# EAGLE design LB_BIT_o14_BRIGHTLED-v03(rev3) (EAGLE 6.6.0)
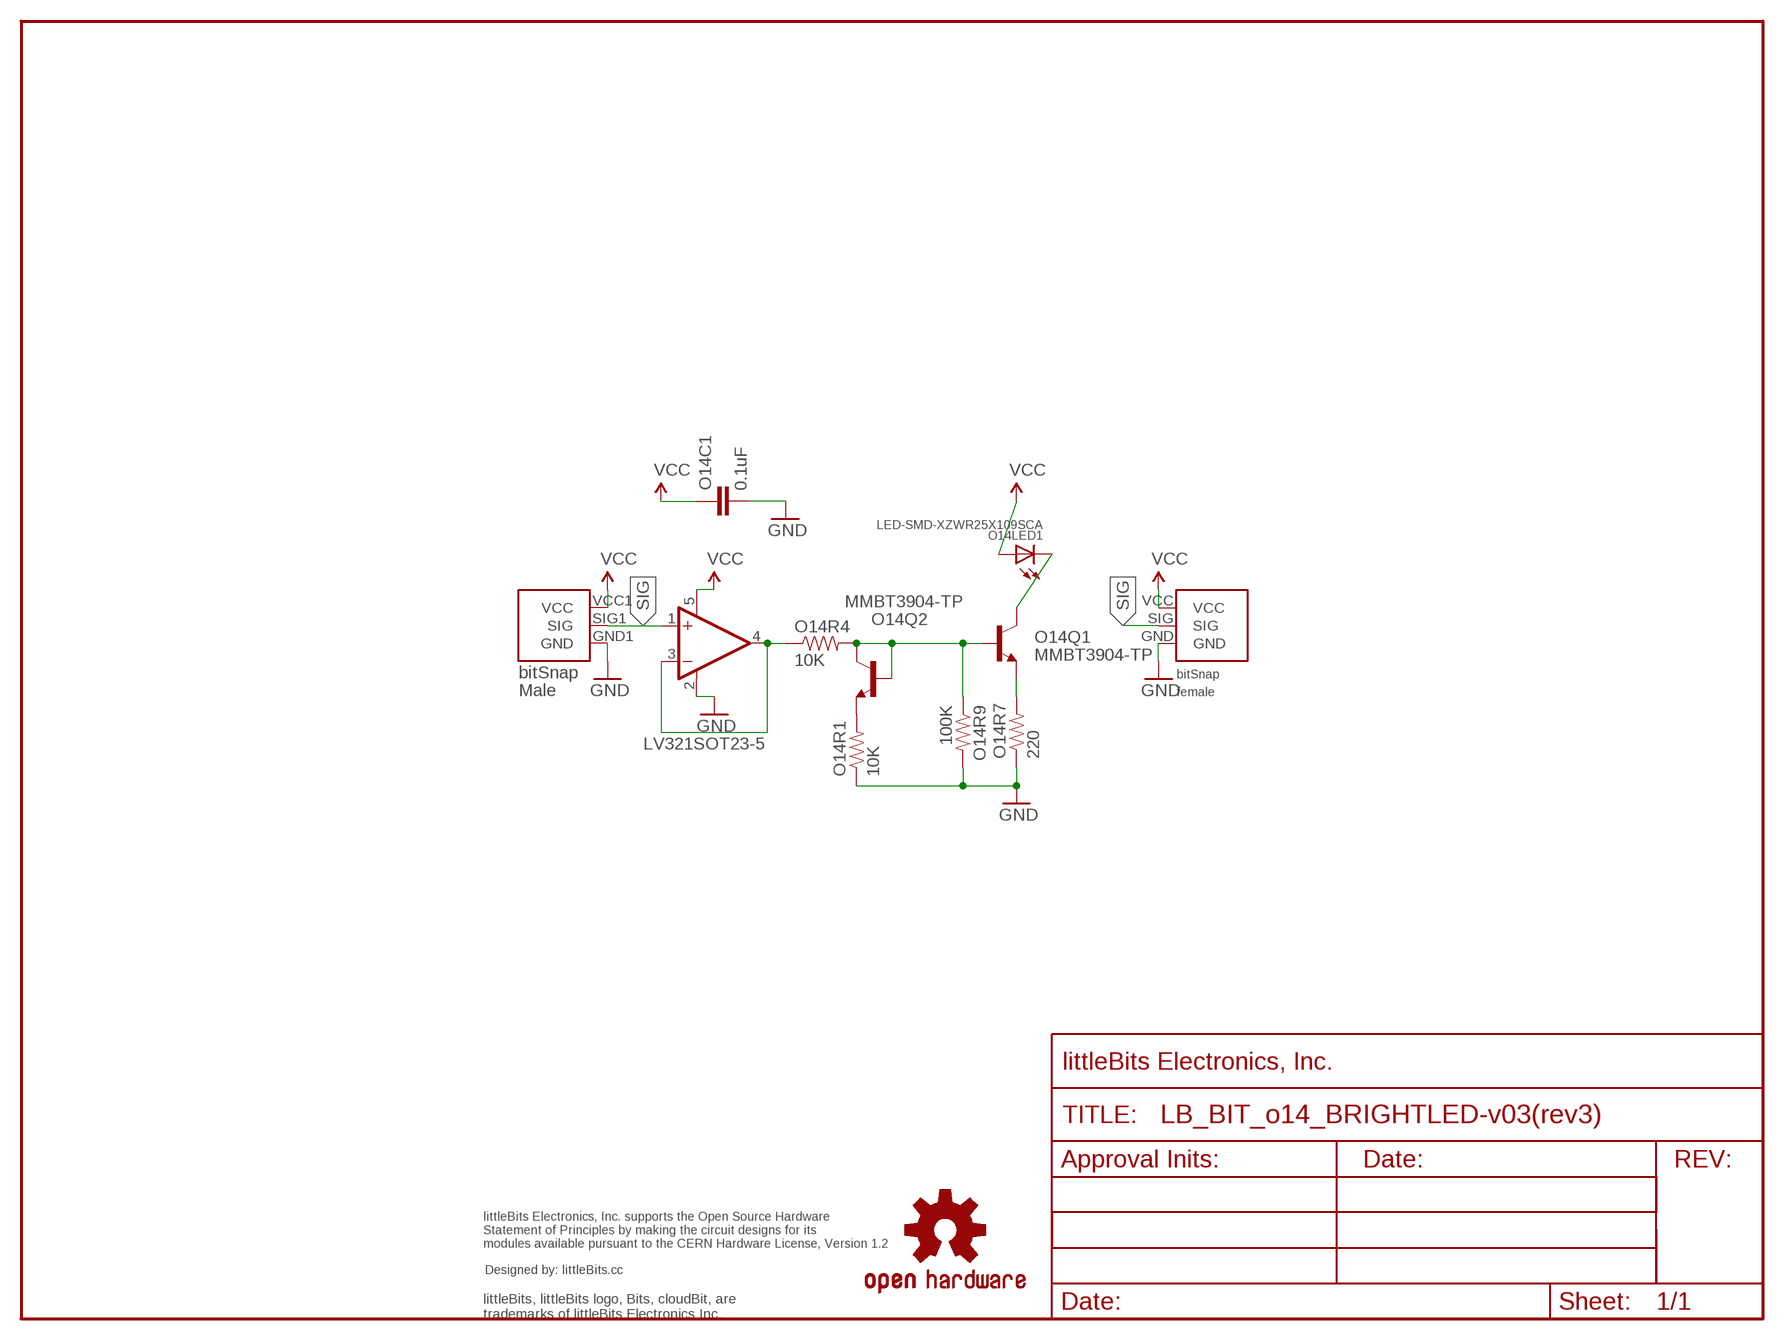
[diagram p0: schematic, sheet 1]

## Parts
O14BSF1  BITSNAP_V03_FEMALE  [BITSNAP_V03_FEMALE]
O14BSM1  BITSNAP_V03_MALE  [BITSNAP_V03_MALE]
O14C1  0.1uF  CAP0603-CAP  [0603-CAP]
O14LED1  LED-SMD-XZWR25X109SCA  [LED-SMD-XZWR25X109SCA]
O14Q1  MMBT3904-TP  TRANSISTOR_NPNSOT23  [SOT23]
O14Q2  MMBT3904-TP  TRANSISTOR_NPNSOT23  [SOT23]
O14R1  10K  RESISTOR0603-RES  [0603-RES]
O14R4  10K  RESISTOR0603-RES  [0603-RES]
O14R7  220  RESISTOR0603-RES  [0603-RES]
O14R9  100K  RESISTOR0603-RES  [0603-RES]
O14U2  LV321SOT23-5  [SOT23-5]
U$1  OSHWCREDIT  [OSHWCREDIT]
U$6  OSHW-LOGOL  [OSHW-LOGO-L]
U$16  FRAME-LETTER-OHWOHW  [FABDWG01-OHW]

## Nets
GND: O14BSF1.GND O14BSM1.GND1(GND) O14C1.2 O14R1.1 O14R7.1 O14R9.2 O14U2.2(V-)
N$1: O14Q1.1(B) O14Q2.1(B) O14Q2.3(C) O14R4.2 O14R9.1
N$2: O14Q1.2(E) O14R7.2
N$3: O14Q2.2(E) O14R1.2
N$9: O14R4.1 O14U2.3(-IN) O14U2.4(OUT)
SIG: O14BSF1.SIG O14BSM1.SIG1(SIG) O14U2.1(+IN)
THERMAL: O14LED1.C O14Q1.3(C)
VCC: O14BSF1.VCC O14BSM1.VCC1(VCC) O14C1.1 O14LED1.A O14U2.5(V+)

## Library data of the parts
O14BSF1 = bitSnap:BITSNAP_V03_FEMALE
O14BSM1 = bitSnap:BITSNAP_V03_MALE
O14C1 = SparkFun:CAP: Capacitor Standard 0603 ceramic capacitor, and 0.1" leaded capacitor.
O14LED1 = LITTLEBITS:LED-SMD-XZWR25X109SCA
O14Q1 O14Q2 = SparkFun:TRANSISTOR_NPN: Transistor NPN BJT configuration in SOT23 package. MMBT2222 is the common NPN we use. Double check BCE configuration again layout.
O14R1 O14R4 O14R7 O14R9 = SparkFun:RESISTOR: Resistor Basic schematic elements and footprints for 0603, 1206, and PTH 1/10th watt (small) resistors.
O14U2 = LITTLEBITS:LV321
U$1 = LITTLEBITS:OSHWCREDIT
U$6 = SparkFun_NEW:OSHW-LOGO: Open Source Hardware Logo This logo indicates the piece of hardware it is found on incorporates a OSHW license and/or adheres to the definition of open source hardware found here: http://freedomdefined.org/OSHW
U$16 = LITTLEBITS:FRAME-LETTER-OHW

## Board
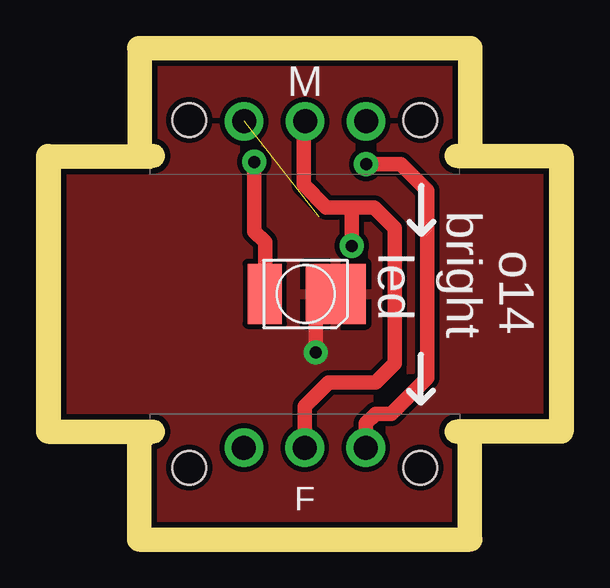
[diagram p1: board, top side]
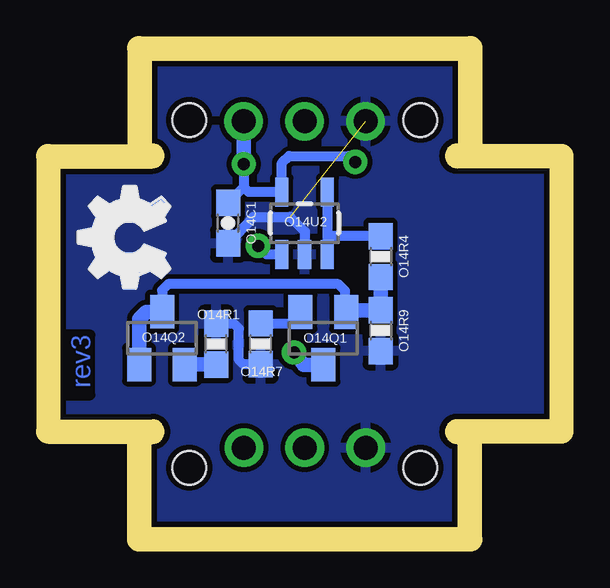
[diagram p2: board, bottom side, seen from below]

Size 20.4 x 19.5 mm. Coordinates in mm from the lower left corner, seen from the top.
Outline: 0,15 0,4.5
Outline: 20.4,4.5 20.4,15
Copper layers (1*16): Top 0.035mm / dielectric 1.5mm / Bottom 0.035mm
Design rules "default": minimum track width 8mil, minimum drill 20mil, track to track 8mil, track to pad 8mil, pad to pad 8mil, via to via 8mil, smd to smd 8mil, copper to edge 10mil, drill to drill 8mil, minimum pad ring 12mil, minimum via ring 10mil, stop-mask expansion 4mil, vias tented up to drill 25mil, thermal gap 10mil
Milling: 2 lines

### Footprints (pad centres in the part's own frame; a part is rotated, then mirrored left to right if it is on the bottom)
BITSNAP_V03_FEMALE = drill 1: GND 3.91,3.33; SIG 6.45,3.33; VCC 8.99,3.33 | hole 1.4: 1.63,2.5; 11.27,2.5
BITSNAP_V03_MALE = drill 1: GND1 8.98,2.56; SIG1 6.44,2.56; VCC1 3.9,2.56 | hole 1.4: 11.27,2.5; 1.63,2.5
0603-CAP = smd 1.1 x 1: 1 -0.85,0; 2 0.85,0
LED-SMD-XZWR25X109SCA = smd 1.422 x 2.5: A 0.05,1.406 | smd 2.5 x 2.5: C 3,1.4
SOT23 = smd 1 x 1.4: 1 -0.95,-1.1; 2 0.95,-1.1; 3 0,1.1
0603-RES = smd 1.1 x 1: 1 -0.85,0; 2 0.85,0
SOT23-5 = smd 0.55 x 1.2: 1 -0.95,-1.3; 2 0,-1.3; 3 0.95,-1.3; 4 0.95,1.3; 5 -0.95,1.3

### Placement (x,y rotation side)
O14BSF1  3.75,0 0 top
O14BSM1  16.65,19.5 180 top
O14C1  13.4,12.7 270 bottom
O14LED1  8.48,8.34 0 top
O14Q1  9.43,7.89 180 bottom
O14Q2  16.15,7.9 0 bottom
O14R1  13.9,7.65 270 bottom
O14R4  7.04,11.3 270 bottom
O14R7  12.04,7.66 90 bottom
O14R9  7.04,8.21 270 bottom
O14U2  10.21,12.69 0 bottom
U$1  -79.8,-74.3 0 top  (outside the outline)
U$2  [OSHW_FILLX150_NOTEXT]  15.82,9.15 0 top
U$6  -19.65,-79.4 0 top  (outside the outline)
U$16  11.1,-9.05 0 top  (outside the outline)

### Tracks (layer width: path | path; a pad name or v marks a point on that pad's centre or on a via)
GND  (1 unrouted)
  Bottom 0.406: 10.24,11.33 O14U2.2 10.2,12.35 10.8,12.95 12.35,12.95 O14C1.2 | O14R7.1 12.76,6.81 12.95,7 12.95,8.3 13.15,8.5 O14R1.1
  pour Bottom: 0.25,19.25 20.15,19.25 20.15,0.25 0.25,0.25
N$1
  Bottom 0.406: 8.52,9 8.52,9.87 8.8,10.15 15.9,10.15 16.15,9.9 O14Q2.3
  Bottom 0.61: 8.52,9 O14Q1.1 8.48,9.06 O14R9.1 O14R4.2 | O14Q2.3 16.8,9 17.1,8.7 O14Q2.1
N$2
  Bottom 0.406: O14R7.2 10.46,8.51 10.45,8.5 10.45,8.92 O14Q1.2
N$3
  Bottom 0.61: O14R1.2 O14Q2.2
N$9
  Bottom 0.406: O14U2.4 9.26,12.15 | 9.26,12.15 O14U2.3 | O14R4.1 9.26,12.15
SIG  (via drill 0.5)
  Top 0.61: O14BSF1.SIG 10.2,5.05 11.2,6.05 13.15,6.05 13.95,6.85 13.95,12.5 13.1,13.35 12.15,13.35 | O14BSM1.SIG1 10.15,16.88 10.15,14.3 11.1,13.35 12.15,13.35 | v12.15,11.75 12.15,13.35
  Bottom 0.406: O14U2.1 11.79,11.39 v12.15,11.75
THERMAL  (via drill 0.5)
  Top 0.61: v10.65,7.3 10.65,9.67 O14LED1.C
  Bottom 0.61: O14Q1.3 10.24,6.79 v10.65,7.3
  pour Top: 0.25,19.25 20.15,19.25 20.15,0.25 0.25,0.25
VCC  (via drill 0.5)
  Top 0.61: v12.75,15.15 14.2,15.15 15.3,14.05 15.3,6.25 13.8,4.75 13.15,4.75 12.74,4.34 O14BSF1.VCC | v8.1,15.25 8.1,12.35 8.55,11.9 8.55,9.77 O14LED1.A
  Bottom 0.406: v12.75,15.15 12.75,14.2 | 12.75,14.2 O14C1.1 | 12.75,14.2 12.54,13.99 O14U2.5 11.16,15.21 11.14,15.21 10.85,15.5 8.35,15.5 v8.1,15.25
  Bottom 0.61: v12.75,15.15 O14BSM1.VCC1

### Text on the board
Bottom: rev3
tPlace: bright | o14 | led
Milling: 1mm DIA. ROUTER PATH
dxf: 3 | o13 BRIGHT LED BIT PCB
tDocu: O14LED1